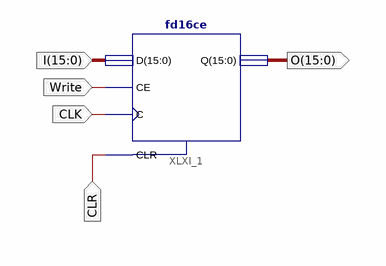
[diagram p0: schematic sheet 1]
// Xilinx ISE schematic RegWithReset.sch (spartan3adsp) as structural Verilog: 1 symbols, 5 ports
module RegWithReset (
  input  CLR,
  input  CLK,
  input  Write,
  input  [15:0] I,
  output [15:0] O
);

  fd16ce XLXI_1 (.C(CLK), .CE(Write), .CLR(CLR), .D(I), .Q(O));
endmodule
